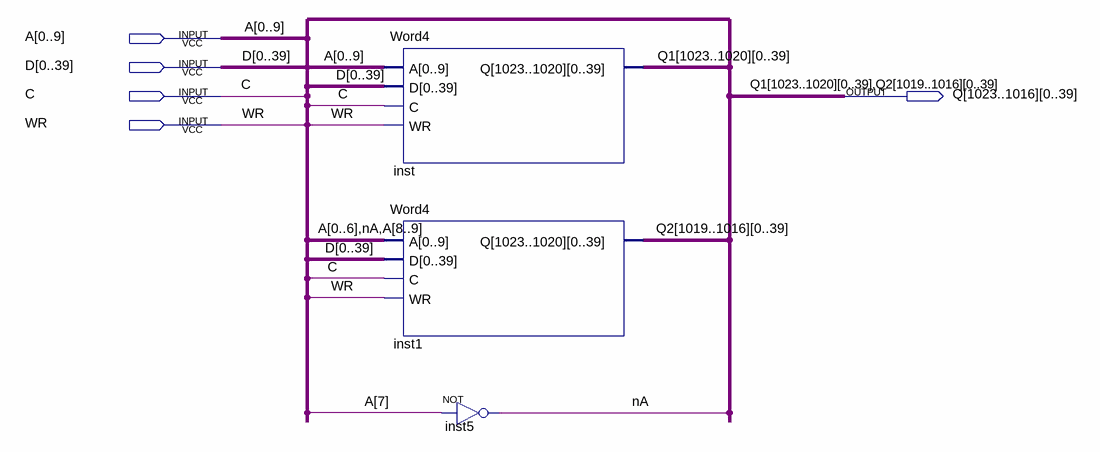
[diagram p0: schematic sheet]
// Quartus schematic Word8.bdf as structural Verilog: 3 symbols, 5 pins
module Word8 (
  input  [0:9] A,
  input  [0:39] D,
  input  C,
  input  WR,
  output [39:0] Q_1023,
  output [39:0] Q_1022,
  output [39:0] Q_1021,
  output [39:0] Q_1020,
  output [39:0] Q_1019,
  output [39:0] Q_1018,
  output [39:0] Q_1017,
  output [39:0] Q_1016
);

  wire nA;

  Word4 inst (
    .A(A), .D(D), .C(C), .WR(WR),
    .Q({Q_1023[0], Q_1023[1], Q_1023[2], Q_1023[3], Q_1023[4], Q_1023[5], Q_1023[6], Q_1023[7], Q_1023[8], Q_1023[9], Q_1023[10], Q_1023[11], Q_1023[12], Q_1023[13], Q_1023[14], Q_1023[15], Q_1023[16], Q_1023[17], Q_1023[18], Q_1023[19], Q_1023[20], Q_1023[21], Q_1023[22], Q_1023[23], Q_1023[24], Q_1023[25], Q_1023[26], Q_1023[27], Q_1023[28], Q_1023[29], Q_1023[30], Q_1023[31], Q_1023[32], Q_1023[33], Q_1023[34], Q_1023[35], Q_1023[36], Q_1023[37], Q_1023[38], Q_1023[39], Q_1022[0], Q_1022[1], Q_1022[2], Q_1022[3], Q_1022[4], Q_1022[5], Q_1022[6], Q_1022[7], Q_1022[8], Q_1022[9], Q_1022[10], Q_1022[11], Q_1022[12], Q_1022[13], Q_1022[14], Q_1022[15], Q_1022[16], Q_1022[17], Q_1022[18], Q_1022[19], Q_1022[20], Q_1022[21], Q_1022[22], Q_1022[23], Q_1022[24], Q_1022[25], Q_1022[26], Q_1022[27], Q_1022[28], Q_1022[29], Q_1022[30], Q_1022[31], Q_1022[32], Q_1022[33], Q_1022[34], Q_1022[35], Q_1022[36], Q_1022[37], Q_1022[38], Q_1022[39], Q_1021[0], Q_1021[1], Q_1021[2], Q_1021[3], Q_1021[4], Q_1021[5], Q_1021[6], Q_1021[7], Q_1021[8], Q_1021[9], Q_1021[10], Q_1021[11], Q_1021[12], Q_1021[13], Q_1021[14], Q_1021[15], Q_1021[16], Q_1021[17], Q_1021[18], Q_1021[19], Q_1021[20], Q_1021[21], Q_1021[22], Q_1021[23], Q_1021[24], Q_1021[25], Q_1021[26], Q_1021[27], Q_1021[28], Q_1021[29], Q_1021[30], Q_1021[31], Q_1021[32], Q_1021[33], Q_1021[34], Q_1021[35], Q_1021[36], Q_1021[37], Q_1021[38], Q_1021[39], Q_1020[0], Q_1020[1], Q_1020[2], Q_1020[3], Q_1020[4], Q_1020[5], Q_1020[6], Q_1020[7], Q_1020[8], Q_1020[9], Q_1020[10], Q_1020[11], Q_1020[12], Q_1020[13], Q_1020[14], Q_1020[15], Q_1020[16], Q_1020[17], Q_1020[18], Q_1020[19], Q_1020[20], Q_1020[21], Q_1020[22], Q_1020[23], Q_1020[24], Q_1020[25], Q_1020[26], Q_1020[27], Q_1020[28], Q_1020[29], Q_1020[30], Q_1020[31], Q_1020[32], Q_1020[33], Q_1020[34], Q_1020[35], Q_1020[36], Q_1020[37], Q_1020[38], Q_1020[39]}));
  Word4 inst1 (
    .A({A[0:6], nA, A[8:9]}), .D(D), .C(C), .WR(WR),
    .Q({Q_1019[0], Q_1019[1], Q_1019[2], Q_1019[3], Q_1019[4], Q_1019[5], Q_1019[6], Q_1019[7], Q_1019[8], Q_1019[9], Q_1019[10], Q_1019[11], Q_1019[12], Q_1019[13], Q_1019[14], Q_1019[15], Q_1019[16], Q_1019[17], Q_1019[18], Q_1019[19], Q_1019[20], Q_1019[21], Q_1019[22], Q_1019[23], Q_1019[24], Q_1019[25], Q_1019[26], Q_1019[27], Q_1019[28], Q_1019[29], Q_1019[30], Q_1019[31], Q_1019[32], Q_1019[33], Q_1019[34], Q_1019[35], Q_1019[36], Q_1019[37], Q_1019[38], Q_1019[39], Q_1018[0], Q_1018[1], Q_1018[2], Q_1018[3], Q_1018[4], Q_1018[5], Q_1018[6], Q_1018[7], Q_1018[8], Q_1018[9], Q_1018[10], Q_1018[11], Q_1018[12], Q_1018[13], Q_1018[14], Q_1018[15], Q_1018[16], Q_1018[17], Q_1018[18], Q_1018[19], Q_1018[20], Q_1018[21], Q_1018[22], Q_1018[23], Q_1018[24], Q_1018[25], Q_1018[26], Q_1018[27], Q_1018[28], Q_1018[29], Q_1018[30], Q_1018[31], Q_1018[32], Q_1018[33], Q_1018[34], Q_1018[35], Q_1018[36], Q_1018[37], Q_1018[38], Q_1018[39], Q_1017[0], Q_1017[1], Q_1017[2], Q_1017[3], Q_1017[4], Q_1017[5], Q_1017[6], Q_1017[7], Q_1017[8], Q_1017[9], Q_1017[10], Q_1017[11], Q_1017[12], Q_1017[13], Q_1017[14], Q_1017[15], Q_1017[16], Q_1017[17], Q_1017[18], Q_1017[19], Q_1017[20], Q_1017[21], Q_1017[22], Q_1017[23], Q_1017[24], Q_1017[25], Q_1017[26], Q_1017[27], Q_1017[28], Q_1017[29], Q_1017[30], Q_1017[31], Q_1017[32], Q_1017[33], Q_1017[34], Q_1017[35], Q_1017[36], Q_1017[37], Q_1017[38], Q_1017[39], Q_1016[0], Q_1016[1], Q_1016[2], Q_1016[3], Q_1016[4], Q_1016[5], Q_1016[6], Q_1016[7], Q_1016[8], Q_1016[9], Q_1016[10], Q_1016[11], Q_1016[12], Q_1016[13], Q_1016[14], Q_1016[15], Q_1016[16], Q_1016[17], Q_1016[18], Q_1016[19], Q_1016[20], Q_1016[21], Q_1016[22], Q_1016[23], Q_1016[24], Q_1016[25], Q_1016[26], Q_1016[27], Q_1016[28], Q_1016[29], Q_1016[30], Q_1016[31], Q_1016[32], Q_1016[33], Q_1016[34], Q_1016[35], Q_1016[36], Q_1016[37], Q_1016[38], Q_1016[39]}));
  not inst5 (nA, A[7]);

  // Other names for the same wires on the sheet: Q1_1020[39:0] = Q_1020; Q1_1021[39:0] = Q_1021;
  //   Q1_1022[39:0] = Q_1022; Q1_1023[39:0] = Q_1023; Q2_1016[39:0] = Q_1016; Q2_1017[39:0] = Q_1017;
  //   Q2_1018[39:0] = Q_1018; Q2_1019[39:0] = Q_1019
endmodule
